# EAGLE design scematics (EAGLE 9.4.2)
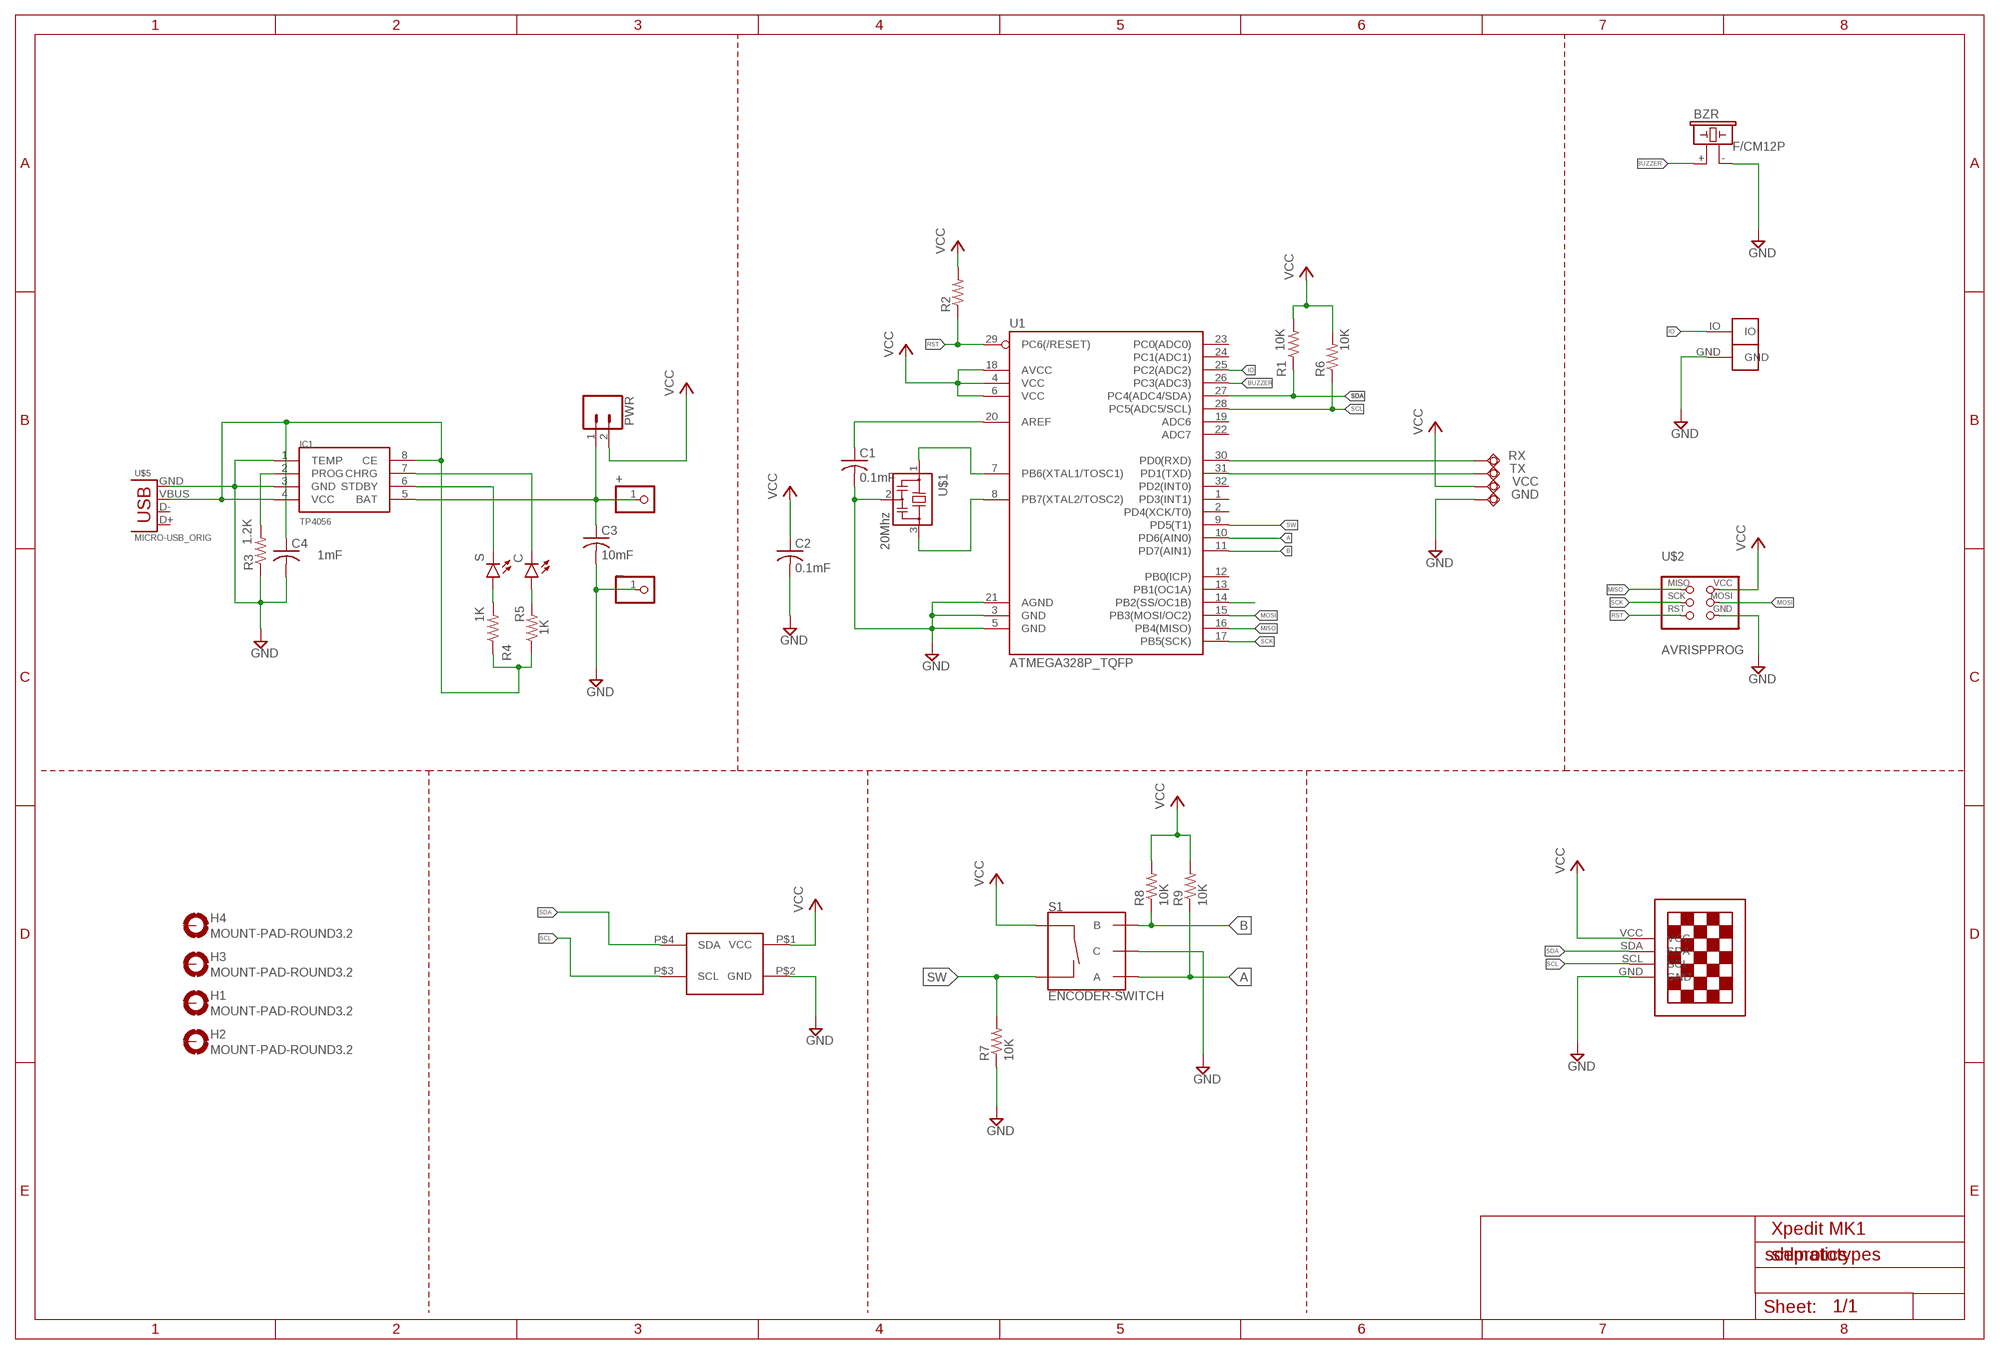
[diagram p0: schematic, sheet 1]

## Parts
+  PINHD-1X1  [1X01]
_  PINHD-1X1  [1X01]
BZR  F/CM12P  [F/CM12P]
C  LEDSML0805  [SML0805]
C1  0.1mF  C-USC0805  [C0805]
C2  0.1mF  C-USC0805  [C0805]
C3  10mF  C-USC0805  [C0805]
C4  1mF  C-USC0805  [C0805]
GND  TPSQTP16R  [TP16R]
H1  MOUNT-PAD-ROUND3.2  [3,2-PAD]
H2  MOUNT-PAD-ROUND3.2  [3,2-PAD]
H3  MOUNT-PAD-ROUND3.2  [3,2-PAD]
H4  MOUNT-PAD-ROUND3.2  [3,2-PAD]
IC1  TP4056  [SOP-8]
PWR  CONN_02  [1X02]
R1  10K  R-US_R0805  [R0805]
R2  R-US_R0805  [R0805]
R3  1.2K  R-US_R0805  [R0805]
R4  1K  R-US_R0805  [R0805]
R5  1K  R-US_R0805  [R0805]
R6  10K  R-US_R0805  [R0805]
R7  10K  R-US_R0805  [R0805]
R8  10K  R-US_R0805  [R0805]
R9  10K  R-US_R0805  [R0805]
RX  TPSQTP16R  [TP16R]
S  LEDSML0805  [SML0805]
S1  ENCODER-SWITCH  [ROTARY_ENC_PLAIN]
TAPTIC  VIBRARTOR  [VIBRATOR]
TX  TPSQTP16R  [TP16R]
U1  ATMEGA328P_TQFP  [TQFP32-08]
U$1  20Mhz  RESONATOR  [EFOBM]
U$2  AVRISPPROG  [SMD]
U$3  BME280  [BME280]
U$4  13"OLED13"OLED  [1.3"OLED]
U$5  MICRO-USB_ORIG  [DX4R005HJ5]
VCC  TPSQTP16R  [TP16R]

## Nets
A: R9.1 S1.A U1.10(PD6(AIN0))
B: R8.1 S1.B U1.11(PD7(AIN1))
BUZZER: BZR.+ U1.26(PC3(ADC3))
CS: U1.14(PB2(SS/OC1B))
GND: _.1 BZR.- C1.2 C2.2 C3.2 C4.2 GND.TP IC1.1(TEMP) IC1.3(GND) R3.1 R7.1 S1.C TAPTIC.GND U1.3(GND) U1.5(GND) U1.21(AGND) U$1.2 U$2.6(GND) U$3.P$2(GND) U$4.GND U$5.GND
IO: TAPTIC.IO U1.25(PC2(ADC2))
MISO: U1.16(PB4(MISO)) U$2.1(MISO)
MOSI: U1.15(PB3(MOSI/OC2)) U$2.5(MOSI)
N$1: U1.7(PB6(XTAL1/TOSC1)) U$1.1
N$2: U1.8(PB7(XTAL2/TOSC2)) U$1.3
N$3: RX.TP U1.30(PD0(RXD))
N$4: TX.TP U1.31(PD1(TXD))
N$5: +.1 C3.1 IC1.5(BAT) PWR.1
N$6: C1.1 U1.20(AREF)
N$7: IC1.2(PROG) R3.2
N$10: C4.1 IC1.4(VCC) IC1.8(CE) R4.1 R5.1 U$5.VBUS
N$11: IC1.6(STDBY) S.C
N$12: C.C IC1.7(CHRG)
N$13: C.A R5.2
N$14: R4.2 S.A
RST: R2.1 U1.29(PC6(/RESET)) U$2.3(RST)
SCK: U1.17(PB5(SCK)) U$2.2(SCK)
SCL: R6.1 U1.28(PC5(ADC5/SCL)) U$3.P$3(SCL) U$4.SCL
SDA: R1.1 U1.27(PC4(ADC4/SDA)) U$3.P$4(SDA) U$4.SDA
SW: R7.2 S1.SW- U1.9(PD5(T1))
VCC: C2.1 PWR.2 R1.2 R2.2 R6.2 R8.2 R9.2 S1.SW+ U1.4(VCC) U1.6(VCC) U1.18(AVCC) U$2.4(VCC) U$3.P$1(VCC) U$4.VCC VCC.TP
Unconnected: H1.B3,2(MOUNT) H2.B3,2(MOUNT) H3.B3,2(MOUNT) H4.B3,2(MOUNT) U1.1(PD3(INT1)) U1.2(PD4(XCK/T0)) U1.12(PB0(ICP)) U1.13(PB1(OC1A)) U1.19(ADC6) U1.22(ADC7) U1.23(PC0(ADC0)) U1.24(PC1(ADC1)) U1.32(PD2(INT0)) U$5.D+ U$5.D-

## Notes on the sheet
- Xpedit MK1
- shlprototypes

## Library data of the parts
+ _ = pinhead:PINHD-1X1: PIN HEADER
BZR = buzzer:F/CM12P: BUZZER Source: Buerklin; OC_FARNELL: unknown; OC_NEWARK: unknown
C S = led:LED: LED OSRAM: - CHIPLED LG R971, LG N971, LY N971, LG Q971, LY Q971, LO R971, LY R971 LH N974, LH R974 LS Q976, LO Q976, LY Q976 LO Q996 - Hyper CHIPLED LW Q18S LB Q993, LB Q99A, LB R99A - SideLED LS A670, LO A670, LY A670, LG A670, LP A670 LB A673, LV A673, LT A673, LW A673 LH A674 LY A675 LS A676, LA A676, LO A676, LY A676, LW A676 LS A679, LY A679, LG A679 - Hyper Micro SIDELED® LS Y876, LA Y876, LO Y876, LY Y876 LT Y87S - SmartLED LW L88C, LW L88S LB L89C, LB L89S, LG L890 LS L89K, LO L89K, LY L89K LS L896, LA L896, LO L896, LY L896 - TOPLED LS T670, LO T670, LY T670, LG T670, LP T670 LSG T670, LSP T670, LSY T670, LOP T670, LYG T670 LG T671, LOG T671, LSG T671 LB T673, LV T673, LT T673, LW T673 LH T674 LS T676, LA T676, LO T676, LY T676, LB T676, LH T676, LSB T676, LW T676 LB T67C, LV T67C, LT T67C, LS T67K, LO T67K, LY T67K, LW E67C LS E67B, LA E67B, LO E67B, LY E67B, LB E67C, LV E67C, LT E67C LW T67C LS T679, LY T679, LG T679 LS T770, LO T770, LY T770, LG T770, LP T770 LB T773, LV T773, LT T773, LW T773 LH T774 LS E675, LA E675, LY E675, LS T675 LS T776, LA T776, LO T776, LY T776, LB T776 LHGB T686 LT T68C, LB T68C - Hyper Mini TOPLED® LB M676 - Mini TOPLED Santana® LG M470 LS M47K, LO M47K, LY M47K Source: http://www.osram.convergy.de LUXEON: - LUMILED® LXK2-PW12-R00, LXK2-PW12-S00, LXK2-PW14-U00, LXK2-PW14-V00 LXK2-PM12-R00, LXK2-PM12-S00, LXK2-PM14-U00 LXK2-PE12-Q00, LXK2-PE12-R00, LXK2-PE12-S00, LXK2-PE14-T00, LXK2-PE14-U00 LXK2-PB12-K00, LXK2-PB12-L00, LXK2-PB12-M00, LXK2-PB14-N00, LXK2-PB14-P00, LXK2-PB14-Q00 LXK2-PR12-L00, LXK2-PR12-M00, LXK2-PR14-Q00, LXK2-PR14-R00 LXK2-PD12-Q00, LXK2-PD12-R00, LXK2-PD12-S00 LXK2-PH12-R00, LXK2-PH12-S00 LXK2-PL12-P00, LXK2-PL12-Q00, LXK2-PL12-R00 Source: www.luxeon.com KINGBRIGHT: KA-3528ASYC Source: www.kingbright.com
C1-C4 = rcl:C-US: CAPACITOR, American symbol; SPICEPREFIX: C
GND RX TX VCC = testpad:TPSQ: Test pad
H1-H4 = holes:MOUNT-PAD-ROUND: MOUNTING PAD, round
IC1 = TP4056:TP4056
PWR = SparkFun-Connectors:CONN_02: Multi connection point. Often used as Generic Header-pin footprint for 0.1 inch spaced/style header connections On any of the 0.1 inch spaced packages, you can populate with these: Break Away Headers - Straight <https://www.sparkfun.com/products/116> (PRT-00116) Break Away Male Headers - Right Angle <https://www.sparkfun.com/products/553> (PRT-00553) Female Headers <https://www.sparkfun.com/products/115> (PRT-00115) Break Away Headers - Machine Pin <https://www.sparkfun.com/products/117> (PRT-00117) Break Away Female Headers - Swiss Machine Pin <https://www.sparkfun.com/products/743> (PRT-00743) For SCREWTERMINALS and SPRING TERMINALS visit here: Screw Terimnals on SparkFun.com <https://www.sparkfun.com/search/results?term=Screw+Terminals> (5mm/3.5mm/2.54mm spacing) This device is also useful as a general connection point to wire up your design to another part of your project. Our various solder wires solder well into these plated through hole pads. Hook-Up Wire - Assortment (Stranded, 22 AWG) <https://www.sparkfun.com/products/11375> (PRT-11375) Hook-Up Wire - Assortment (Solid Core, 22 AWG) <https://www.sparkfun.com/products/11367> (PRT-11367) View the entire wire category on our website here <https://www.sparkfun.com/categories/141> Special notes: Molex polarized connector foot print use with: PRT-08233 with associated crimp pins and housings. 2.54_SCREWTERM for use with PRT-10571. 3.5mm Screw Terminal footprints for PRT-08084 5mm Screw Terminal footprints for use with PRT-08432
R1-R9 = rcl:R-US_: RESISTOR, American symbol; SPICEPREFIX: R
S1 = SparkFun-Switches:ENCODER-SWITCH: Rotary Encoder w/ Select Switch Encoders rotate similarly to potentiometers, but they’re different from potentiometers in that an encoder has full rotation without limits. They output gray code so that you can tell how much and in which direction the encoder has been turned. This encoder includes a push-down select switch built into the shaft. SparkFun Products Rotary Encoder <https://www.sparkfun.com/products/9117> (COM-09117); SF_SKU: COM-09117
TAPTIC = vibrator:VIBRARTOR
U1 = SparkFun-IC-Microcontroller:ATMEGA328P_TQFP: Popular 328P in QFP Storefront component: ATmega328 - TQFP <https://www.sparkfun.com/products/13448> (COM-13448) Datasheet <http://www.sparkfun.com/datasheets/Components/SMD/ATMega328.pdf> SparkFun Products SparkFun RedBoard - Programmed with Arduino <https://www.sparkfun.com/products/12757> (DEV-12757) Arduino Pro Mini 328 - 5V/16MHz <https://www.sparkfun.com/products/11113> (DEV-11113) Arduino Pro Mini 328 - 3.3V/8MHz <https://www.sparkfun.com/products/11114> (DEV-11114) SparkFun OpenLog <https://www.sparkfun.com/products/13712> (DEV-13712) SparkFun MicroView - OLED Arduino Module <https://www.sparkfun.com/products/12923> (DEV-12923) SparkFun Digital Sandbox <https://www.sparkfun.com/products/12651> (DEV-12651) SparkFun PicoBoard <https://www.sparkfun.com/products/11888> (WIG-11888) Arduino Fio <https://www.sparkfun.com/products/10116> (DEV-10116) LilyPad Arduino 328 Main Board <https://www.sparkfun.com/products/13342> (DEV-13342) SparkFun RedStick <https://www.sparkfun.com/products/13741> (DEV-13741) LilyPad MP3 <https://www.sparkfun.com/products/11013> (DEV-11013) LilyPad Arduino SimpleSnap <https://www.sparkfun.com/products/10941> (DEV-10941) SparkFun Stepoko <https://www.sparkfun.com/products/13899> (ROB-13899) SparkFun Geiger Counter <https://www.sparkfun.com/products/11345> (SEN-11345) SparkFun EL Sequencer <https://www.sparkfun.com/products/12781> (COM-12781) Arduino Pro 328 - 5V/16MHz <https://www.sparkfun.com/products/10915> (DEV-10915) CryptoCape <https://www.sparkfun.com/products/12773> (DEV-12773) SparkFun IR Thermometer Evaluation Board - MLX90614 <https://www.sparkfun.com/products/10740> (SEN-10740) SparkFun RedBot Mainboard <https://www.sparkfun.com/products/12097> (ROB-12097) Arduino Pro 328 - 3.3V/8MHz <https://www.sparkfun.com/products/10914> (DEV-10914) SparkFun Block for Intel® Edison - Arduino <https://www.sparkfun.com/products/13036> (DEV-13036) SparkFun Simon Says - Surface Mount Soldering Kit <https://www.sparkfun.com/products/10935> (KIT-10935) SparkFun 7-Segment Serial Display - Red <https://www.sparkfun.com/products/11441> (COM-11441) SparkFun 7-Segment Serial Display - White <https://www.sparkfun.com/products/11629> (COM-11629) SparkFun 7-Segment Serial Display - Yellow <https://www.sparkfun.com/products/11443> (COM-11443) SparkFun 7-Segment Serial Display - Kelly Green <https://www.sparkfun.com/products/11440> (COM-11440) SparkFun 7-Segment Serial Display - Blue <https://www.sparkfun.com/products/11442> (COM-11442) SparkFun OpenSegment Serial Display - 20mm (Blue) <https://www.sparkfun.com/products/11647> (COM-11647) SparkFun OpenSegment Serial Display - 20mm (Green) <https://www.sparkfun.com/products/11646> (COM-11646) SparkFun OpenSegment Serial Display - 20mm (White) <https://www.sparkfun.com/products/11648> (COM-11648) SparkFun OpenSegment Serial Display - 20mm (Red) <https://www.sparkfun.com/products/11644> (COM-11644) SparkFun OpenSegment Serial Display - 20mm (Yellow) <https://www.sparkfun.com/products/11645> (COM-11645) SparkFun OpenSegment Shield <https://www.sparkfun.com/products/13190> (DEV-13190); PROD_ID: IC-09069
U$1 = fab:RESONATOR
U$2 = ispvpro:AVRISPPROG
U$3 = bme280:BME280
U$4 = 13oled:13"OLED
U$5 = fab:MICRO-USB: SMD micro USB connector as found in the fablab inventory. Three footprint variants included: original, as described by manufacturer's datasheet for milling with the 1/100" bit for milling with the 1/64" bit Made by Zaerc.

## Board
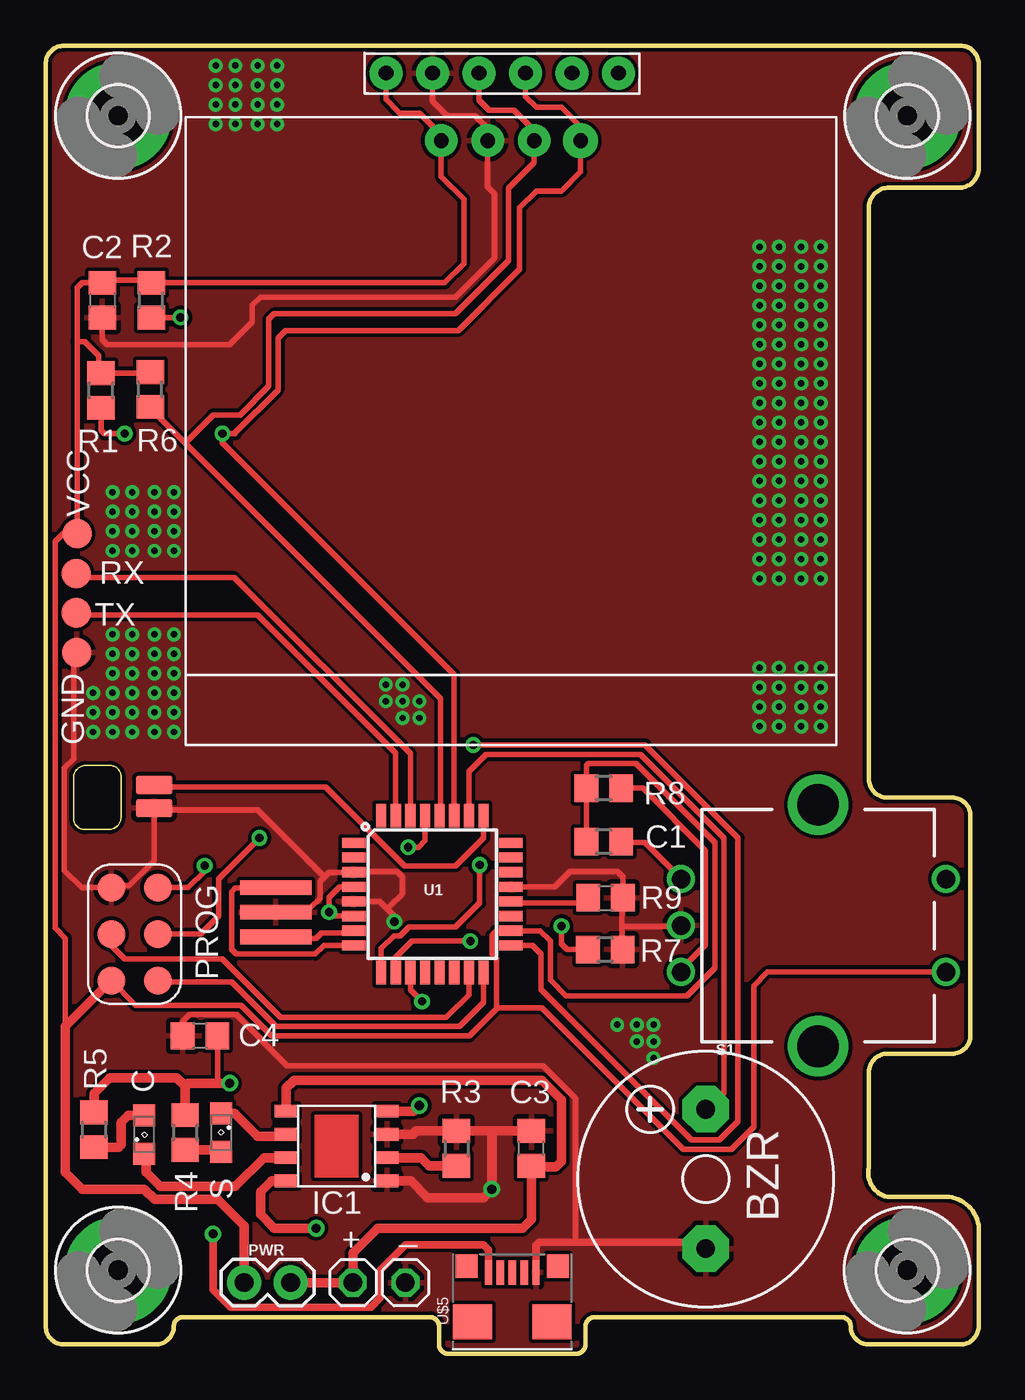
[diagram p1: board, top side]
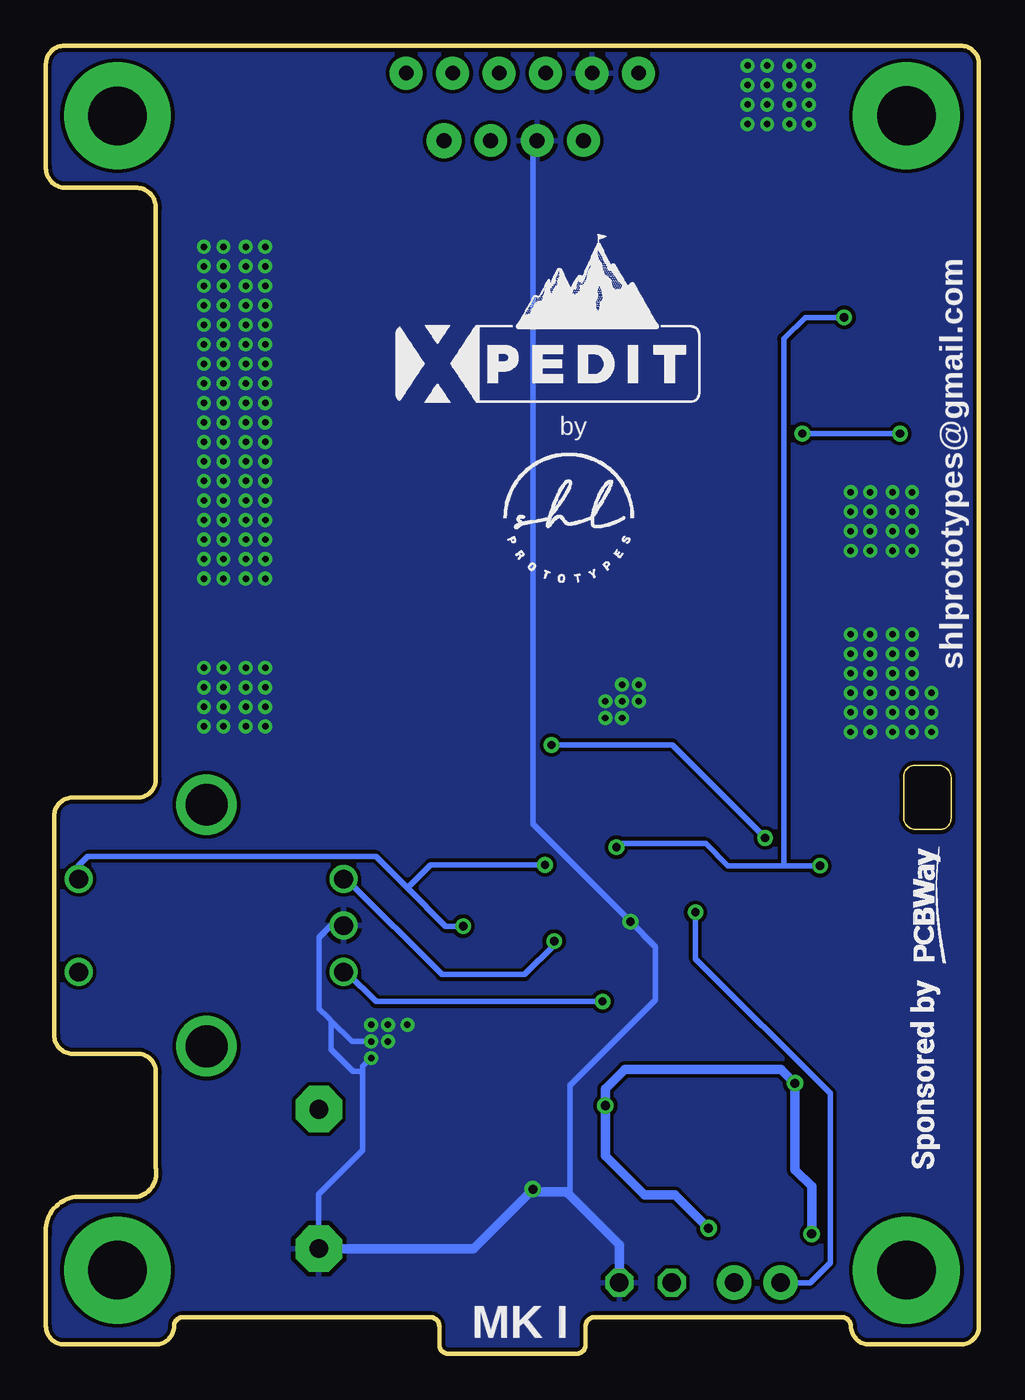
[diagram p2: board, bottom side, seen from below]

Size 51.01 x 71.49 mm. Coordinates in mm from the lower left corner, seen from the top.
Outline: 0,70.49 0,1.51 arc90 1,0.51 6,0.51 arc90 7,1.51 7,1.5 arc-90 7.5,2 21,2 arc-90 21.5,1.5 21.5,0.5 arc90 22,0 29,0 arc90 29.5,0.5 29.5,1.5 arc-90 30,2 43.5,2 arc-90 44,1.5 44,1.51 arc90 45,0.51 50,0.51 arc90 51,1.51 51,6.51 arc90 49.39,8.57 46,8.57 arc-90 45,10.18 45,15.4 arc-90 46,16.4 49.55,16.4 arc90 50.55,17.4 50.55,29.4 arc90 49.55,30.4 46,30.4 arc-90 45,31.4 45,62.58 arc-90 46,63.73 50,63.73 arc90 51,64.88 51,70.49 arc90 50,71.49 1,71.49 arc90 0,70.49
Outline: 4.12,31.55 4.12,29.41 arc-90 3.5,28.65 2.13,28.65 arc-90 1.52,29.26 1.52,31.39 arc-90 2.13,32.16 3.5,32.16 arc-90 4.12,31.55
Copper layers (1*16): Top 0.035mm / dielectric 1.5mm / Bottom 0.035mm
Design rules "default *": minimum track width 12mil, minimum drill 0.35mm, track to track 8mil, track to pad 8mil, pad to pad 8mil, via to via 8mil, smd to smd 8mil, copper to edge 8mil, drill to drill 8mil, minimum pad ring 10mil, minimum via ring 8mil, stop-mask expansion 1mil, vias tented up to drill 20mil, thermal gap 10mil

### Footprints (pad centres in the part's own frame; a part is rotated, then mirrored left to right if it is on the bottom)
1X01 = drill 1.016 octagon: 1 0,0
F/CM12P = drill 1.016 pad 2.54 octagon: + 3.81,0; - -3.81,0
SML0805 = smd 1.2 x 1.2: A 1.05,0; C -1.05,0
C0805 = smd 1.3 x 1.5: 1 -0.95,0; 2 0.95,0
TP16R = smd 1.6 x 1.6: TP 0,0
3,2-PAD = drill 3.2 pad 5.842: B3,2 0,0
SOP-8 = smd 1.3 x 0.7: 1 -2.75,1.905; 2 -2.75,0.635; 3 -2.75,-0.635; 4 -2.75,-1.905; 5 2.75,-1.905; 6 2.75,-0.635; 7 2.75,0.635; 8 2.75,1.905
1X02 = drill 1.016 pad 1.88: 1 0,0; 2 2.54,0
R0805 = smd 1.3 x 1.5: 1 -0.95,0; 2 0.95,0
ROTARY_ENC_PLAIN = drill 1.016: A 7.493,-2.54; B 7.493,2.54; C 7.493,0; SW+ -6.985,2.54; SW- -6.985,-2.54 | drill 2.286: P$3 0,6.604; P$4 0,-6.604
VIBRATOR = smd 1 x 2: GND 1.27,0; IO 0,0
TQFP32-08 = smd 1.27 x 0.559: 1 -4.293,2.8; 2 -4.293,2; 3 -4.293,1.2; 4 -4.293,0.4; 5 -4.293,-0.4; 6 -4.293,-1.2; 7 -4.293,-2; 8 -4.293,-2.8; 17 4.293,-2.8; 18 4.293,-2; 19 4.293,-1.2; 20 4.293,-0.4; 21 4.293,0.4; 22 4.293,1.2; 23 4.293,2; 24 4.293,2.8 | smd 0.559 x 1.27: 9 -2.8,-4.293; 10 -2,-4.293; 11 -1.2,-4.293; 12 -0.4,-4.293; 13 0.4,-4.293; 14 1.2,-4.293; 15 2,-4.293; 16 2.8,-4.293; 25 2.8,4.293; 26 2,4.293; 27 1.2,4.293; 28 0.4,4.293; 29 -0.4,4.293; 30 -1.2,4.293; 31 -2,4.293; 32 -2.8,4.293
EFOBM = smd 0.8 x 3.9: 1 -1.35,0; 2 0,0; 3 1.35,0
SMD = smd 1.524 x 1.524: 1 -1.27,2.54; 2 -1.27,0; 3 -1.27,-2.54; 4 1.27,2.54; 5 1.27,0; 6 1.27,-2.54
BME280 = drill 0.8 pad 1.8: P$1 -6.367,0.011; P$2 -3.827,0.011; P$3 -1.287,0.011; P$4 1.253,0.011; P$5 3.793,0.011; P$6 6.333,0.011
1.3"OLED = drill 0.8 pad 1.778: GND 2.54,0; SCL 5.08,0; VCC 0,0 | drill 0.8 pad 1.9: SDA 7.62,0
DX4R005HJ5 = smd 0.4 x 1.35: D+ 0,1.6; D- -0.65,1.6; GND 1.3,1.6; ID 0.65,1.6; VBUS -1.3,1.6 | smd 1.2 x 1.3: GND@1 -2.5,1.95; GND@2 2.5,1.95 | smd 2.15 x 1.9: GND@3 -2.175,-1.1; GND@4 2.175,-1.1

### Placement (x,y rotation side)
+  16.79,3.89 0 top
_  19.66,3.89 0 top
BZR  36.08,9.55 90 top
C  5.38,11.99 90 top
C1  30.61,24.92 0 top
C2  3.1,57.58 270 top
C3  26.54,11.23 90 top
C4  8.43,17.37 180 top
GND  1.7,38.33 0 top
H1  3.96,4.57 0 top
H2  47.09,67.67 0 top
H3  47.09,4.57 0 top
H4  3.96,67.67 0 top
IC1  15.9,11.35 180 top
PWR  13.39,3.89 180 top
R1  3.02,52.65 90 top
R2  5.77,57.58 90 top
R3  22.45,11.23 270 top
R4  7.62,12.09 270 top
R5  2.64,12.24 270 top
R6  5.71,52.71 90 top
R7  30.59,22.09 180 top
R8  30.51,30.91 180 top
R9  30.51,27.99 180 top
RX  1.66,42.65 0 top
S  9.6,12.09 270 top
S1  42.22,23.41 180 top
TAPTIC  5.92,31.09 270 top
TX  1.68,40.5 0 top
U1  21.13,25.12 0 top
U$1  12.57,24.13 90 top
U$2  4.85,22.94 180 top
U$3  24.97,69.98 0 top
U$4  21.62,66.3 0 top
U$5  25.5,2.85 0 top
VCC  1.72,44.84 0 top

### Tracks (layer width: path | path; a pad name or v marks a point on that pad's centre or on a via)
A  (via drill 0.45)
  Top 0.305: v23.22,22.55 20.02,22.55 19.05,21.59 19.05,20.83 U1.10 | R9.1 31.5,27.94 32.77,27.94 34.54,26.16 S1.A
  Bottom 0.305: S1.A 34.54,25.91 29.36,20.73 24.84,20.73 23.22,22.35 v23.22,22.55
B  (via drill 0.45)
  Top 0.305: S1.B 34.8,21.08 36.07,22.35 36.07,27.48 32.64,30.91 R8.1 | U1.11 19.93,19.89 v20.57,19.25
  Bottom 0.305: v20.57,19.25 32.97,19.25 34.54,20.83 S1.B
BUZZER
  Top 0.305: BZR.+ 36.32,13.46 37.08,14.22 37.08,28.19 32.51,32.77 24.08,32.77 23.13,31.82 U1.26
GND  (via drill 0.35, 0.45, 0.5 pad 0.8)
  Top 0.305: U$1.2 12.7,24.38 14.48,24.38 14.99,24.89 14.99,25.81 15.24,26.06 | GND.TP 1.52,38.1 1.52,32.51 1.02,32 1.02,26.42 1.96,25.48 U$2.6 3.71,25.6 4.57,25.6 5.92,26.95 TAPTIC.GND 6.1,29.72 11.58,29.72 15.24,26.06 | 31.5,23.37 31.5,24.89 C1.2 31.56,26.05 31.24,26.36 28.65,26.36 27.81,25.52 U1.21 | 31.5,23.37 31.5,22.1 R7.1 | 31.5,23.37 34.54,23.37 S1.C | C2.2 3.1,55.42 3.35,55.17 10.06,55.17 11.28,56.39 11.28,57.3 11.73,57.76 22.4,57.76 24.54,59.89 24.54,63.4 24.16,63.78 U$4.GND 24.16,66.98 23.47,67.67 21.95,67.67 21.15,68.47 U$3.P$2 | 15.24,26.06 15.5,26.32 U1.3 16.89,26.36 19.2,26.36 19.51,26.06 19.51,25.15 18.75,24.38 18.75,24.23 | C4.2 7.47,17.39 7.47,18.14 7.87,18.54 10.41,18.54 13.21,15.75 27.18,15.75 28.96,13.97 28.96,6.1 | U1.5 18.26,24.72 18.75,24.23 | v19.05,23.62 19.05,23.93 18.75,24.23
  Top 0.406: U$5.GND 26.8,5.92 26.98,6.1 28.96,6.1 35.73,6.1 BZR.-
  Top 0.508: C3.2 24.54,12.18 | 24.54,12.18 R3.1 | R3.1 | IC1.3 20.07,11.99 20.25,12.18 R3.1 | 24.54,12.18 24.38,12.02 v24.38,8.99 23.93,8.53 20.88,8.53 19.96,9.45 IC1.1
  Bottom 0.305: 22.48,8.76 22.35,8.89 22.35,14.68 17.68,19.36 17.68,22.25 v19.05,23.62 24.38,28.96 24.38,66.08 U$4.GND | BZR.- 36.08,8.72 33.68,11.12 33.68,15.32 | S1.C 35.42,23.41 36.07,22.76 36.07,18.86 35.59,18.38 35.42,18.21 | v33.22,17.07 34.28,17.07 35.42,18.21 | v33.22,16.15 33.68,15.7 33.68,15.32 | 33.68,15.32 33.78,15.42 34.21,15.42 35.42,16.63 35.42,18.21
  Bottom 0.508: BZR.- 27.64,5.74 v24.38,8.99 24.23,8.84 22.55,8.84 22.48,8.76 19.66,5.94 _.1
  other vias: 3.66,39.32 4.72,39.32 4.72,38.25 3.66,38.25 3.66,37.19 4.72,37.19 3.66,36.12 4.72,36.12 4.72,35.05 3.66,35.05 3.66,33.99 4.72,33.99 2.59,36.12 2.59,35.05 2.59,33.99 5.94,39.32 7.01,39.32 7.01,38.25 5.94,38.25 5.94,37.19 7.01,37.19 5.94,36.12 7.01,36.12 7.01,35.05 5.94,35.05 5.94,33.99 7.01,33.99 39.01,54.1 40.08,54.1 40.08,53.04 39.01,53.04 39.01,51.97 40.08,51.97 39.01,50.9 40.08,50.9 40.08,49.83 39.01,49.83 39.01,48.77 40.08,48.77 41.3,54.1 42.37,54.1 42.37,53.04 41.3,53.04 41.3,51.97 42.37,51.97 41.3,50.9 42.37,50.9 42.37,49.83 41.3,49.83 41.3,48.77 42.37,48.77 39.01,47.7 40.08,47.7 40.08,46.63 39.01,46.63 39.01,45.57 40.08,45.57 39.01,44.5 40.08,44.5 40.08,43.43 39.01,43.43 39.01,42.37 40.08,42.37 41.3,47.7 42.37,47.7 42.37,46.63 41.3,46.63 41.3,45.57 42.37,45.57 41.3,44.5 42.37,44.5 42.37,43.43 41.3,43.43 41.3,42.37 42.37,42.37 39.01,60.5 40.08,60.5 40.08,59.44 39.01,59.44 39.01,58.37 40.08,58.37 39.01,57.3 40.08,57.3 40.08,56.24 39.01,56.24 39.01,55.17 40.08,55.17 41.3,60.5 42.37,60.5 42.37,59.44 41.3,59.44 41.3,58.37 42.37,58.37 41.3,57.3 42.37,57.3 42.37,56.24 41.3,56.24 41.3,55.17 42.37,55.17 9.3,70.41 10.36,70.41 10.36,69.34 9.3,69.34 9.3,68.28 10.36,68.28 9.3,67.21 10.36,67.21 11.58,70.41 12.65,70.41 12.65,69.34 11.58,69.34 11.58,68.28 12.65,68.28 11.58,67.21 12.65,67.21 39.01,37.49 40.08,37.49 40.08,36.42 39.01,36.42 39.01,35.36 40.08,35.36 39.01,34.29 40.08,34.29 41.3,37.49 42.37,37.49 42.37,36.42 41.3,36.42 41.3,35.36 42.37,35.36 41.3,34.29 42.37,34.29 3.66,47.09 4.72,47.09 4.72,46.02 3.66,46.02 3.66,44.96 4.72,44.96 3.66,43.89 4.72,43.89 5.94,47.09 7.01,47.09 7.01,46.02 5.94,46.02 5.94,44.96 7.01,44.96 5.94,43.89 7.01,43.89 31.24,17.98 32.31,17.98 33.22,17.98 32.31,17.07 18.59,35.66 19.51,35.66 20.42,35.66 20.42,34.75 19.51,34.75 18.59,36.58 19.51,36.58
  pour Bottom: -1.07,73 -1.07,-0.76 -0.91,-0.76 52.43,-0.76 52.43,5.33 52.43,73
  pour Top: -1.22,35.51 -1.22,-0.91 3.66,-0.91 52.12,-0.91 52.12,10.21 52.12,39.78 -1.98,39.78 -1.98,35.66 -1.22,35.66
  pour Top: -1.68,73.15 -1.68,39.47 53.64,39.47 53.64,73.15
IO
  Top 0.305: TAPTIC.IO 6.1,30.99 15.3,30.99 19.62,26.67 22.4,26.67 23.93,28.2 U1.25
MISO
  Top 0.305: U$2.1 6.35,20.32 10.16,20.32 12.6,17.88 22.61,17.88 23.93,19.21 U1.16
MOSI
  Top 0.305: U$2.5 3.58,22.33 4.32,21.59 9.65,21.59 12.85,18.39 21.89,18.39 23.13,19.63 U1.15
N$1
  Top 0.305: U1.7 16.73,23.01 15.09,23.01 14.78,22.71 12.65,22.71 U$1.1
N$2
  Top 0.305: 12.45,25.4 U$1.3 12.54,25.45 10.36,25.45 10.16,25.25 10.16,22.1 10.41,21.84 14.73,21.84 15.21,22.32 U1.8
N$3
  Top 0.305: RX.TP 1.78,42.42 10.31,42.42 19.93,32.8 U1.30
N$4
  Top 0.305: TX.TP 1.78,40.39 11.58,40.39 19.13,32.84 U1.31
N$5
  Top 0.508: PWR.1 +.1 16.79,5.51 18.14,6.86 26.06,6.86 26.54,7.34 26.54,10.21 | 26.54,10.21 C3.1 | IC1.5 13.15,14.52 13.56,14.94 27.13,14.94 28.19,13.87 28.19,10.52 27.89,10.21 26.54,10.21
N$6
  Top 0.305: U1.20 25.65,24.64 29.21,24.64 29.46,24.89 C1.1
N$7
  Top 0.508: R3.2 20.96,10.28 20.52,10.72 IC1.2
N$10  (via drill 0.5 pad 0.8)
  Top 0.305: 9.4,14.78 9.4,17.27 C4.1
  Top 0.406: U$5.VBUS 24.2,5.67 23.93,5.94 19.66,5.94 18.29,4.57 18.29,3.05 17.78,2.54 10.11,2.54 9.14,3.5 v9.14,6.55
  Top 0.508: R4.1 7.62,14.63 | 7.62,14.63 7.16,15.09 3.5,15.09 2.64,14.22 R5.1 | IC1.4 20.12,13.26 v20.42,13.56 | v10.06,14.78 9.4,14.78 7.77,14.78 7.62,14.63 | IC1.8 12.35,9.45 11.73,8.84 11.73,7.62 12.5,6.86 v14.78,6.86
  Bottom 0.508: v14.78,6.86 16.61,8.69 18.29,8.69 20.42,10.82 v20.42,13.56 20.42,14.48 19.36,15.54 10.82,15.54 v10.06,14.78 10.06,10.06 9.14,9.14 v9.14,6.55
N$11
  Top 0.508: IC1.6 13.05,11.89 11.58,11.89 10.33,13.14 S.C
N$12
  Top 0.508: C.C 5.49,10.84 5.49,9.91 6.25,9.14 10.36,9.14 11.94,10.72 IC1.7
N$13
  Top 0.508: R5.2 3.98,11.29 4.12,11.43 4.12,12.65 4.5,13.04 C.A
N$14
  Top 0.508: R4.2 9.5,11.14 S.A
RST  (via drill 0.45)
  Top 0.305: v7.37,56.64 5.84,56.64 R2.1 | U1.29 20.73,28.05 20.37,27.69 v19.81,27.69 | U$2.3 7.8,25.48 8.69,26.36 v8.69,26.67
  Bottom 0.305: v8.69,26.67 10.67,26.67 | 10.67,26.67 13.72,26.67 14.94,27.89 19.61,27.89 v19.81,27.69 | v7.37,56.64 9.5,56.64 10.67,55.47 10.67,26.67
SCK  (via drill 0.45)
  Top 0.305: v23.37,33.27 32.77,33.27 37.85,28.19 37.85,12.7 36.83,11.68 35.31,11.68 27.08,19.91 27.08,21.84 26.6,22.32 U1.17 | U$2.2 8.46,22.94 9.45,23.93 9.45,25.96 v11.68,28.19
  Bottom 0.305: v23.37,33.27 16.76,33.27 v11.68,28.19
SCL
  Top 0.305: 7.62,49.78 5.84,51.56 R6.1 | 7.62,49.78 21.59,35.81 21.59,29.46 U1.28 | 7.62,49.78 9.14,51.31 10.62,51.31 12.19,52.88 12.19,56.54 12.5,56.84 22.4,56.84 25.3,59.74 25.3,63.7 26.7,65.1 U$4.SCL 26.7,66.88 25.6,67.97 24.23,67.97 23.69,68.52 U$3.P$3
SDA  (via drill 0.45)
  Top 0.305: U$3.P$4 26.23,68.72 26.82,68.12 28.19,68.12 29.24,67.08 U$4.SDA 29.24,64.59 28.19,63.55 26.82,63.55 25.91,62.64 25.91,59.28 22.55,55.93 13.11,55.93 12.7,55.52 12.7,52.67 10.36,50.34 10.36,50.29 v9.65,50.29 9.65,49.8 22.33,37.12 U1.27 | R1.1 3.02,50.47 3.2,50.29 v4.32,50.29
  Bottom 0.305: v9.65,50.29 v4.32,50.29
SW  (via drill 0.45)
  Top 0.305: 18.29,20.83 U1.9 18.33,22.14 19.03,22.84 19.38,22.84 19.85,23.32 22.4,23.32 23.72,24.64 v23.72,26.72 | R7.2 28.5,22.09 28.19,22.4 v28.19,23.37
  Bottom 0.305: v28.19,23.37 29.16,23.37 31.24,25.45 | 31.24,25.45 32.97,27.18 48.72,27.18 49.23,26.67 49.23,25.96 S1.SW- | v23.72,26.72 29.97,26.72 31.24,25.45
VCC  (via drill 0.45)
  Top 0.305: R6.2 5.59,53.59 3.05,53.59 R1.2 2.9,53.73 2.9,54.56 2.13,55.32 1.78,55.32 | 24.64,18.85 24.64,21.59 24.38,21.84 24.38,22.86 24.64,23.11 25.4,23.11 U1.18 27.02,23.12 27.58,22.55 27.58,20.42 28.45,19.56 35.05,19.56 36.58,21.08 36.58,27.94 32.26,32.26 29.67,32.26 29.57,32.16 R8.2 | R8.2 R9.2 | U$3.P$1 18.61,68.57 19.36,67.82 20.42,67.82 21.62,66.62 U$4.VCC 21.62,64.34 22.86,63.09 22.86,59.59 21.8,58.53 R2.2 5.59,58.67 3.3,58.67 C2.1 1.99,58.53 1.72,58.26 1.72,55.38 1.78,55.32 | U1.6 15.7,23.92 v15.49,24.13 15.49,24.94 16.07,25.52 U1.4 | R8.2 | S1.SW+ 39.46,20.87 38.71,20.12 38.71,12.39 37.49,11.18 34.85,11.18 27.13,18.9 24.69,18.9 24.64,18.85 | 24.64,18.85 23.16,17.37 12.34,17.37 10.67,19.05 4.93,19.05 U$2.4 | 1.78,55.32 1.72,55.26 VCC.TP 0.94,44.84 0.51,44.4 0.51,23.27 1.07,22.71 1.07,17.37
  Top 0.508: PWR.2 10.85,6.99 9.4,8.43 5.95,8.43 5.39,8.99 1.98,8.99 1.07,9.91 1.07,17.37 1.07,17.88 U$2.4
  Bottom 0.305: v15.49,24.13 15.49,21.59 8.13,14.22 8.13,4.98 9.22,3.89 PWR.2

### Text on the board
bPlace: shlprototypes@gmail.com | by | MK I